# EAGLE design tqfp-sandwich-main (EAGLE 9.6.2)
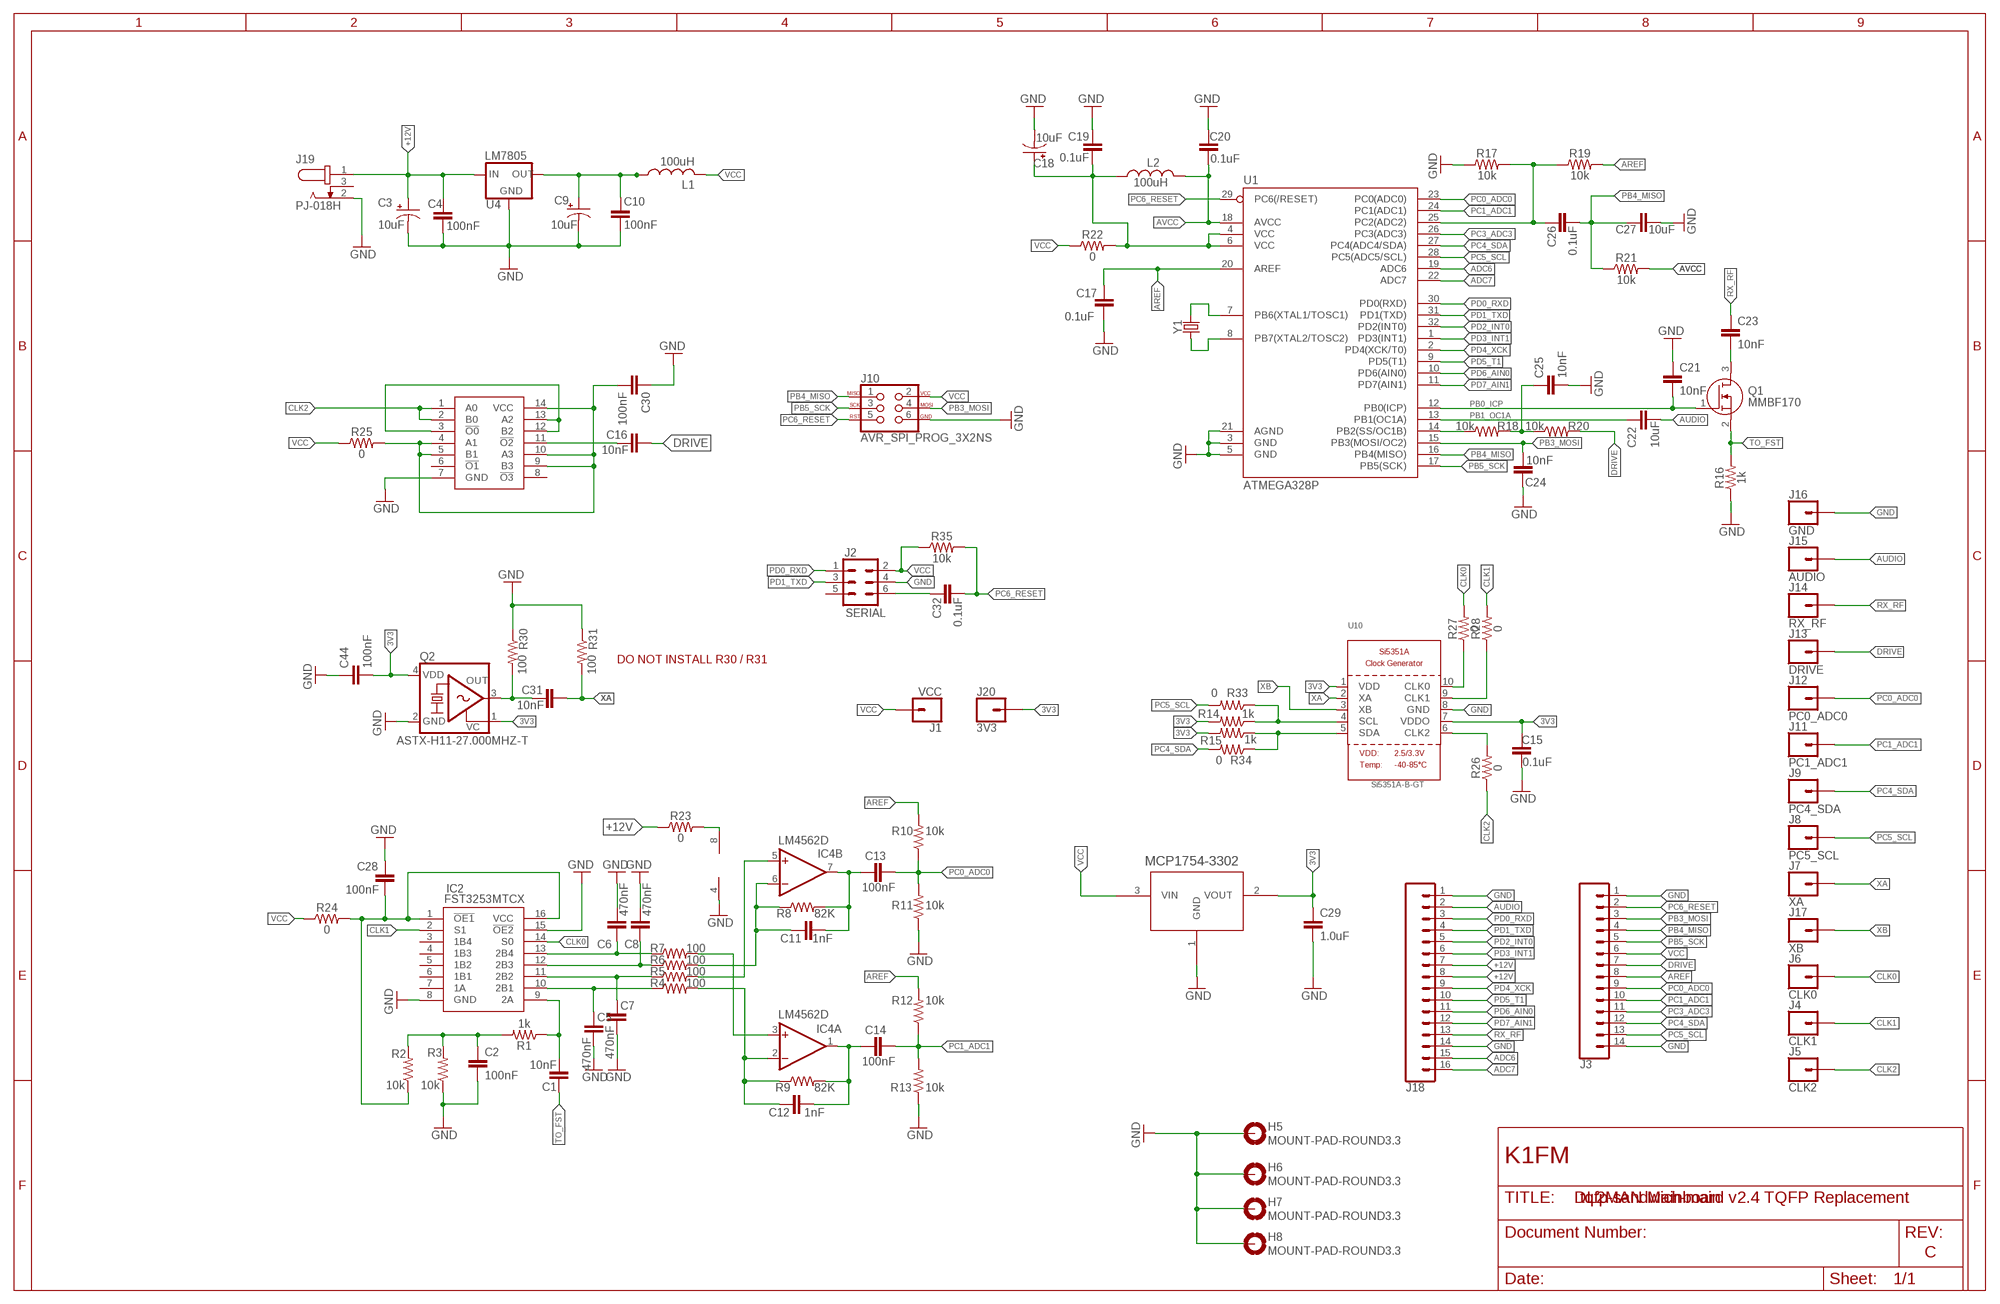
[diagram p0: schematic, sheet 1]

## Parts
C1  10nF  10NF-0603-50V-10%  [0603]
C2  100nF  10NF-0603-50V-10%  [0603]
C3  10uF  10UF-POLAR-EIA3216-16V-10%(TANT)  [EIA3216]
C4  100nF  10NF-0603-50V-10%  [0603]
C5  470nF  470PF-0603-50V-5%  [0603]
C6  470nF  470PF-0603-50V-5%  [0603]
C7  470nF  470PF-0603-50V-5%  [0603]
C8  470nF  470PF-0603-50V-5%  [0603]
C9  10uF  10UF-POLAR-EIA3216-16V-10%(TANT)  [EIA3216]
C10  100nF  10NF-0603-50V-10%  [0603]
C11  1nF  1.0NF/1000PF-0603-50V-10%  [0603]
C12  1nF  1.0NF/1000PF-0603-50V-10%  [0603]
C13  100nF  10NF-0603-50V-10%  [0603]
C14  100nF  10NF-0603-50V-10%  [0603]
C15  0.1uF  0.1UF-0603-25V-(+80/-20%)  [0603]
C16  10nF  10NF-0603-50V-10%  [0603]
C17  0.1uF  0.1UF-0603-25V-(+80/-20%)  [0603]
C18  10uF  10UF-POLAR-EIA3216-16V-10%(TANT)  [EIA3216]
C19  0.1uF  0.1UF-0603-25V-(+80/-20%)  [0603]
C20  0.1uF  0.1UF-0603-25V-(+80/-20%)  [0603]
C21  10nF  10NF-0603-50V-10%  [0603]
C22  10uF  10UF-0603-6.3V-20%  [0603]
C23  10nF  10NF-0603-50V-10%  [0603]
C24  10nF  10NF-0603-50V-10%  [0603]
C25  10nF  10NF-0603-50V-10%  [0603]
C26  0.1uF  0.1UF-0603-25V-(+80/-20%)  [0603]
C27  10uF  10NF-0603-50V-10%  [0603]
C28  100nF  10NF-0603-50V-10%  [0603]
C29  1.0uF  1.0UF-0603-16V-10%  [0603]
C30  100nF  10NF-0603-50V-10%  [0603]
C31  10nF  10NF-0603-50V-10%  [0603]
C32  0.1uF  0.1UF-0603-25V-(+80/-20%)  [0603]
C44  100nF  10NF-0603-50V-10%  [0603]
H5  MOUNT-PAD-ROUND3.3  [3,3-PAD]
H6  MOUNT-PAD-ROUND3.3  [3,3-PAD]
H7  MOUNT-PAD-ROUND3.3  [3,3-PAD]
H8  MOUNT-PAD-ROUND3.3  [3,3-PAD]
IC2  FST3253MTCX  [SOP65P640X110-16N]
IC3  74ACT00MTC  [SOP65P640X120-14N]
IC4  LM4562D  [SO08]
J1  VCC  CONN_01PTH_NO_SILK_KIT  [1X01NS_KIT]
J2  SERIAL  CONN_03X2FEMALE  [2X3]
J3  CONN_14  [1X14]
J4  CLK1  CONN_01PTH_LONGPAD  [1X01_LONGPAD]
J5  CLK2  CONN_01PTH_LONGPAD  [1X01_LONGPAD]
J6  CLK0  CONN_01PTH_LONGPAD  [1X01_LONGPAD]
J7  XA  CONN_01PTH_LONGPAD  [1X01_LONGPAD]
J8  PC5_SCL  CONN_01PTH_LONGPAD  [1X01_LONGPAD]
J9  PC4_SDA  CONN_01PTH_LONGPAD  [1X01_LONGPAD]
J10  AVR_SPI_PROG_3X2NS  [2X3-NS]
J11  PC1_ADC1  CONN_01PTH_LONGPAD  [1X01_LONGPAD]
J12  PC0_ADC0  CONN_01PTH_LONGPAD  [1X01_LONGPAD]
J13  DRIVE  CONN_01PTH_LONGPAD  [1X01_LONGPAD]
J14  RX_RF  CONN_01PTH_LONGPAD  [1X01_LONGPAD]
J15  AUDIO  CONN_01PTH_LONGPAD  [1X01_LONGPAD]
J16  GND  CONN_01PTH_LONGPAD  [1X01_LONGPAD]
J17  XB  CONN_01PTH_LONGPAD  [1X01_LONGPAD]
J18  CONN_16  [1X16]
J19  PJ-018H  [CUI_PJ-018H]
J20  3V3  CONN_01PTH_NO_SILK_KIT  [1X01NS_KIT]
L1  100uH  INDUCTOR_0805_L  [RESC0805_L]
L2  100uH  INDUCTOR_0805_L  [RESC0805_L]
Q1  MMBF170  [SOT96P237X111-3N]
Q2  ASTX-H11-27.000MHZ-T  KXO-VCXO-SINE-84  [3.2X2.5_KXO-84]
R1  1k  1KOHM-0603-1/10W-1%  [0603]
R2  10k  10KOHM-0603-1/10W-1%  [0603]
R3  10k  10KOHM-0603-1/10W-1%  [0603]
R4  100  100OHM-0603-1/4W-5%  [0603]
R5  100  100OHM-0603-1/4W-5%  [0603]
R6  100  100OHM-0603-1/4W-5%  [0603]
R7  100  100OHM-0603-1/4W-5%  [0603]
R8  82K  82OHM-0603-1/10W-1%  [0603]
R9  82K  82OHM-0603-1/10W-1%  [0603]
R10  10k  10KOHM-0603-1/10W-1%  [0603]
R11  10k  10KOHM-0603-1/10W-1%  [0603]
R12  10k  10KOHM-0603-1/10W-1%  [0603]
R13  10k  10KOHM-0603-1/10W-1%  [0603]
R14  1k  1KOHM-0603-1/10W-1%  [0603]
R15  1k  1KOHM-0603-1/10W-1%  [0603]
R16  1k  1KOHM-0603-1/10W-1%  [0603]
R17  10k  10KOHM-0603-1/10W-1%  [0603]
R18  10k  10KOHM-0603-1/10W-1%  [0603]
R19  10k  10KOHM-0603-1/10W-1%  [0603]
R20  10k  10KOHM-0603-1/10W-1%  [0603]
R21  10k  10KOHM-0603-1/10W-1%  [0603]
R22  0  0OHM-0603-1/10W-5%  [0603]
R23  0  0OHM-0603-1/10W-5%  [0603]
R24  0  0OHM-0603-1/10W-5%  [0603]
R25  0  0OHM-0603-1/10W-5%  [0603]
R26  0  0OHM-0603-1/10W-5%  [0603]
R27  0  0OHM-0603-1/10W-5%  [0603]
R28  0  0OHM-0603-1/10W-5%  [0603]
R30  100  1KOHM-0603-1/10W-1%  [0603]
R31  100  1KOHM-0603-1/10W-1%  [0603]
R33  0  0OHM-0603-1/10W-5%  [0603]
R34  0  0OHM-0603-1/10W-5%  [0603]
R35  10k  10KOHM-0603-1/10W-1%  [0603]
U1  ATMEGA328P  ATMEGA328P_TQFP  [TQFP32-08]
U3  MCP1754X-XXXXX/C  [SOT-23A_MC]
U4  LM7805  V_REG_78XX7812  [TO-252]
U10  Si5351A-B-GT  SI5351A  [MSOP10]
Y1  CRYSTALSMD-5X3.2-2PAD  [CRYSTAL-SMD-5X3.2-2PAD]

## Nets
3V3: C15.2 C29.1 C44.2 J20.1 Q2.1(VC) Q2.4(VDD) R14.2 R15.2 U3.2(VOUT) U10.1(VDD) U10.7(VDDO)
5V1: C9.+ C10.2 L1.1 U4.2(OUT)
+12V: C3.+ C4.2 J18.7 J18.8 J19.1 R23.1 U4.1(IN)
ADC6: J18.15 U1.19(ADC6)
ADC7: J18.16 U1.22(ADC7)
AREF: C17.2 J3.8 R10.2 R12.2 R19.2 U1.20(AREF)
AUDIO: C22.2 J15.1 J18.2
AVCC: C20.1 L2.2 R21.2 U1.18(AVCC)
CLK0: IC2.14(S0) J6.1 R27.2
CLK1: IC2.2(S1) J4.1 R28.2
CLK2: IC3.1(A0) IC3.2(B0) J5.1 R26.1
DRIVE: C16.2 J3.7 J13.1 R20.2
GND: C2.2 C3.- C4.1 C5.2 C6.2 C7.2 C8.2 C9.- C10.1 C15.1 C17.1 C18.- C19.2 C20.2 C21.1 C24.1 C25.2 C27.2 C28.1 C29.2 C30.1 C44.1 H5.B3,3(MOUNT) H6.B3,3(MOUNT) H7.B3,3(MOUNT) H8.B3,3(MOUNT) IC2.8(GND) IC2.15(!OE2) IC3.7(GND) IC4.4(P:V-) J2.4 J3.1 J3.14 J10.6 J16.1 J18.1 J18.14 J19.2 Q2.2(GND) R3.1 R11.1 R13.1 R16.1 R17.1 R30.1 R31.1 U1.3(GND) U1.5(GND) U1.21(AGND) U3.1(GND) U4.3(GND) U10.8(GND)
N$1: U1.7(PB6(XTAL1/TOSC1)) Y1.P$2
N$2: U1.8(PB7(XTAL2/TOSC2)) Y1.P$1
N$3: C23.2 Q1.3(D)
N$4: C26.2 R17.2 R19.1 U1.25(PC2(ADC2))
N$5: IC3.3(!O0) IC3.12(B2) IC3.13(A2)
N$6: R18.1 U1.14(PB2(SS/OC1B))
N$7: C25.1 R18.2 R20.1
N$8: C31.1 Q2.3(OUT) R30.2
N$9: C5.1 IC2.10(2B1) R4.1
N$10: C16.1 IC3.11(!O2)
N$11: C18.+ C19.1 L2.1 R22.2 U1.4(VCC) U1.6(VCC)
N$12: C1.2 IC2.9(2A) R1.1
N$13: C2.1 R1.2 R2.2 R3.2
N$14: C7.1 IC2.11(2B2) R5.1
N$15: C8.1 IC2.12(2B3) R6.1
N$16: C6.1 IC2.13(2B4) R7.1
N$17: IC4.5(B:+IN) R5.2
N$18: C12.1 IC4.2(A:-IN) R4.2 R9.1
N$19: C11.1 IC4.6(B:-IN) R6.2 R8.1
N$20: IC4.3(A:+IN) R7.2
N$21: C11.2 C13.1 IC4.7(B:OUT) R8.2
N$22: C12.2 C14.1 IC4.1(A:OUT) R9.2
N$23: IC4.8(P:V+) R23.2
N$24: C28.2 IC2.1(!OE1) IC2.16(VCC) R2.1 R24.2
N$25: C30.2 IC3.4(A1) IC3.5(B1) IC3.9(B3) IC3.10(A3) IC3.14(VCC) R25.2
N$26: R27.1 U10.10(CLK0)
N$27: R28.1 U10.9(CLK1)
N$28: R26.2 U10.6(CLK2)
N$29: R14.1 R33.1 U10.4(SCL)
N$30: R15.1 R34.1 U10.5(SDA)
N$33: C32.2 J2.6
PB0_ICP: C21.2 Q1.1(G) U1.12(PB0(ICP))
PB1_OC1A: C22.1 U1.13(PB1(OC1A))
PB3_MOSI: C24.2 J3.3 J10.4 U1.15(PB3(MOSI/OC2))
PB4_MISO: C26.1 C27.1 J3.4 J10.1 R21.1 U1.16(PB4(MISO))
PB5_SCK: J3.5 J10.3 U1.17(PB5(SCK))
PC0_ADC0: C13.2 J3.9 J12.1 R10.1 R11.2 U1.23(PC0(ADC0))
PC1_ADC1: C14.2 J3.10 J11.1 R12.1 R13.2 U1.24(PC1(ADC1))
PC3_ADC3: J3.11 U1.26(PC3(ADC3))
PC4_SDA: J3.12 J9.1 R34.2 U1.27(PC4(ADC4/SDA))
PC5_SCL: J3.13 J8.1 R33.2 U1.28(PC5(ADC5/SCL))
PC6_RESET: C32.1 J3.2 J10.5 R35.2 U1.29(PC6(/RESET))
PD0_RXD: J2.1 J18.3 U1.30(PD0(RXD))
PD1_TXD: J2.3 J18.4 U1.31(PD1(TXD))
PD2_INT0: J18.5 U1.32(PD2(INT0))
PD3_INT1: J18.6 U1.1(PD3(INT1))
PD4_XCK: J18.9 U1.2(PD4(XCK/T0))
PD5_T1: J18.10 U1.9(PD5(T1))
PD6_AIN0: J18.11 U1.10(PD6(AIN0))
PD7_AIN1: J18.12 U1.11(PD7(AIN1))
RX_RF: C23.1 J14.1 J18.13
TO_FST: C1.1 Q1.2(S) R16.2
VCC: J1.1 J2.2 J3.6 J10.2 L1.2 R22.1 R24.1 R25.1 R35.1 U3.3(VIN)
XA: C31.2 J7.1 R31.2 U10.2(XA)
XB: J17.1 U10.3(XB)
Unconnected: IC2.3(1B4) IC2.4(1B3) IC2.5(1B2) IC2.6(1B1) IC2.7(1A) IC3.6(!O1) IC3.8(!O3) J2.5 J19.3

## Notes on the sheet
- DO NOT INSTALL R30 / R31
- K1FM
- DL2MAN Mainboard v2.4 TQFP Replacement
- C

## Library data of the parts
C1 C16 C21 C23-C25 C31 = SparkFun-Capacitors:10NF: 0.01uF/10nF/10,000pF ceramic capacitors A capacitor is a passive two-terminal electrical component used to store electrical energy temporarily in an electric field. CAP-09321; PROD_ID: CAP-00867
C2 C4 C10 C13 C14 C27 C28 C30 C44 = SparkFun-Capacitors:10NF: 0.01uF/10nF/10,000pF ceramic capacitors A capacitor is a passive two-terminal electrical component used to store electrical energy temporarily in an electric field. CAP-09321; PROD_ID: CAP-00867; VALUE: 10nF
C3 C9 C18 = SparkFun-Capacitors:10UF-POLAR: 10.0µF polarized capacitors A capacitor is a passive two-terminal electrical component used to store electrical energy temporarily in an electric field.; PROD_ID: CAP-00811
C5-C8 = SparkFun-Capacitors:470PF: 470pF ceramic capacitors A capacitor is a passive two-terminal electrical component used to store electrical energy temporarily in an electric field.; PROD_ID: CAP-07884; VALUE: 470pF
C11 C12 = SparkFun-Capacitors:1.0NF/1000PF: 1nF/1,000pF ceramic capacitors A capacitor is a passive two-terminal electrical component used to store electrical energy temporarily in an electric field.; PROD_ID: CAP-07886
C15 C17 C19 C20 C26 C32 = SparkFun-Capacitors:0.1UF: 0.1µF ceramic capacitors A capacitor is a passive two-terminal electrical component used to store electrical energy temporarily in an electric field.; PROD_ID: CAP-00810
C22 = SparkFun-Capacitors:10UF: 10.0µF ceramic capacitors A capacitor is a passive two-terminal electrical component used to store electrical energy temporarily in an electric field.; PROD_ID: CAP-11015
C29 = SparkFun-Capacitors:1.0UF: 1µF ceramic capacitors A capacitor is a passive two-terminal electrical component used to store electrical energy temporarily in an electric field.; PROD_ID: CAP-00868
H5-H8 = holes:MOUNT-PAD-ROUND: MOUNTING PAD, round
IC2 = FST3253MTCX:FST3253MTCX: IC, Fairchild, FST3253MTCX Fairchild Semiconductor FST3253MTCX, Multiplexer/Demultiplexer Dual 4:1 Multiplexer, 4 5.5 V, 16-Pin TSSOP Source: Datasheet <https://componentsearchengine.com/Datasheets/2/FST3253MTCX.pdf>; DESCRIPTION: IC, Fairchild, FST3253MTCX Fairchild Semiconductor FST3253MTCX, Multiplexer/Demultiplexer Dual 4:1 Multiplexer, 4 5.5 V, 16-Pin TSSOP; HEIGHT: 1.1mm; MANUFACTURER_NAME: ON Semiconductor; MANUFACTURER_PART_NUMBER: FST3253MTCX; MOUSER_PART_NUMBER: 512-FST3253MTCX; MOUSER_PRICE-STOCK: https://www.mouser.co.uk/ProductDetail/ON-Semiconductor-Fairchild/FST3253MTCX?qs=9%2FFjV4%2Fi8eqnAjRVZNaJgw%3D%3D
IC3 = 74ACT00MTC:74ACT00MTC: Fairchild Semiconductor 74ACT00MTC, NAND Quad 2 Input NAND, 4.5 5.5 V, 14-Pin TSSOP Source: Datasheet <https://componentsearchengine.com/Datasheets/1/74ACT00MTC.pdf>; DESCRIPTION: Fairchild Semiconductor 74ACT00MTC, NAND Quad 2 Input NAND, 4.5 5.5 V, 14-Pin TSSOP; HEIGHT: 1.2mm; MANUFACTURER_NAME: ON Semiconductor; MANUFACTURER_PART_NUMBER: 74ACT00MTC; MOUSER_PART_NUMBER: 512-74ACT00MTC; MOUSER_PRICE-STOCK: https://www.mouser.com/Search/Refine.aspx?Keyword=512-74ACT00MTC
IC4 = LM4562:LM4562: OP AMP also LM158; LM258; LM2904 Source: http://cache.national.com/ds/LM/LM158.pdf
J1 J4-J9 J11-J17 J20 = SparkFun-Connectors:CONN_01: Single connection point. Often used as Generic Header-pin footprint for 0.1 inch spaced/style header connections On any of the 0.1 inch spaced packages, you can populate with these: Break Away Headers - Straight <https://www.sparkfun.com/products/116> (PRT-00116) Break Away Male Headers - Right Angle <https://www.sparkfun.com/products/553> (PRT-00553) Female Headers <https://www.sparkfun.com/products/115> (PRT-00115) Break Away Headers - Machine Pin <https://www.sparkfun.com/products/117> (PRT-00117) Break Away Female Headers - Swiss Machine Pin <https://www.sparkfun.com/products/743> (PRT-00743) This device is also useful as a general connection point to wire up your design to another part of your project. Our various solder wires solder well into these plated through hole pads. Hook-Up Wire - Assortment (Stranded, 22 AWG) <https://www.sparkfun.com/products/11375> (PRT-11375) Hook-Up Wire - Assortment (Solid Core, 22 AWG) <https://www.sparkfun.com/products/11367> (PRT-11367) View the entire wire category on our website here <https://www.sparkfun.com/categories/141> Special notes: SMTSO-256-ET is a "flush mount" nut for a 4-40 screw. We mostly use this on specialty testbeds; it is a nice way to connect hardware to your PCB at an adjustable hieght. Also note, the SNAP packages are for using a snappable style connector. We sell a baggie of snaps and they are also used on two LilyPad designs: Snap Assortment - 30 pack (male and female) <https://www.sparkfun.com/products/11347> (DEV-11347) LilyPad Arduino SimpleSnap <https://www.sparkfun.com/products/10941> (DEV-10941) LilyPad SimpleSnap Protoboard <https://www.sparkfun.com/products/10940> (DEV-10940)
J2 = SparkFun-Connectors:CONN_03X2: Multi connection point. Often used as Generic Header-pin footprint for 0.1 inch spaced/style header connections You can populate with any combo of single row headers, but if you'd like an exact match, check these: Header - 2x3 (Male, 0.1") <https://www.sparkfun.com/products/12807> (PRT-12807) Header - 2x3 (Female, 0.1") <https://www.sparkfun.com/products/13010> (PRT-13010) 2x3 Pin Shrouded Header <https://www.sparkfun.com/products/10877> (PRT-10877) On any of the 0.1 inch spaced packages, you can populate with these: Break Away Headers - Straight <https://www.sparkfun.com/products/116> (PRT-00116) Break Away Male Headers - Right Angle <https://www.sparkfun.com/products/553> (PRT-00553) Female Headers <https://www.sparkfun.com/products/115> (PRT-00115) Break Away Headers - Machine Pin <https://www.sparkfun.com/products/117> (PRT-00117) Break Away Female Headers - Swiss Machine Pin <https://www.sparkfun.com/products/743> (PRT-00743) Special note: the shrouded connector mates well with our 3x2 ribbon cables: Ribbon Crimp Connector - 6-pin (2x3, Female) <https://www.sparkfun.com/products/10651> (PRT-10651) Ribbon Cable - 6 wire (15ft) <https://www.sparkfun.com/products/10646> (PRT-10646); PROD_ID: CONN-11566; VALUE: FEMALE 2x3
J3 = SparkFun-Connectors:CONN_14: Multi connection point. Often used as Generic Header-pin footprint for 0.1 inch spaced/style header connections On any of the 0.1 inch spaced packages, you can populate with these: Break Away Headers - Straight <https://www.sparkfun.com/products/116> (PRT-00116) Break Away Male Headers - Right Angle <https://www.sparkfun.com/products/553> (PRT-00553) Female Headers <https://www.sparkfun.com/products/115> (PRT-00115) Break Away Headers - Machine Pin <https://www.sparkfun.com/products/117> (PRT-00117) Break Away Female Headers - Swiss Machine Pin <https://www.sparkfun.com/products/743> (PRT-00743) For SCREWTERMINALS and SPRING TERMINALS visit here: Screw Terimnals on SparkFun.com <https://www.sparkfun.com/search/results?term=Screw+Terminals> (5mm/3.5mm/2.54mm spacing) This device is also useful as a general connection point to wire up your design to another part of your project. Our various solder wires solder well into these plated through hole pads. Hook-Up Wire - Assortment (Stranded, 22 AWG) <https://www.sparkfun.com/products/11375> (PRT-11375) Hook-Up Wire - Assortment (Solid Core, 22 AWG) <https://www.sparkfun.com/products/11367> (PRT-11367) View the entire wire category on our website here <https://www.sparkfun.com/categories/141> Special notes: Molex polarized connector foot print use with SKU : PRT-08231 with associated crimp pins and housings. 1MM SMD Version SKU: PRT-10208 NOTES ON THE VARIANTS LOCK and LOCK_LONGPADS... This footprint was designed to help hold the alignment of a through-hole component (i.e. 6-pin header) while soldering it into place. You may notice that each hole has been shifted either up or down by 0.005 of an inch from it's more standard position (which is a perfectly straight line). This slight alteration caused the pins (the squares in the middle) to touch the edges of the holes. Because they are alternating, it causes a "brace" to hold the component in place. 0.005 has proven to be the perfect amount of "off-center" position when using our standard breakaway headers. Although looks a little odd when you look at the bare footprint, once you have a header in there, the alteration is very hard to notice. Also,if you push a header all the way into place, it is covered up entirely on the bottom side.
J10 = SparkFun-Connectors:AVR_SPI_PROG_3X2: AVR ISP 6 Pin This is the reduced ISP connector for AVR programming. Common on Arduino. This footprint will take up less PCB space and can be used with a 10-pin to 6-pin adapter such as SKU: BOB-08508 **Special note about "TEST_POINT" package. The stop mask is on the top side, so if you want your programming test points to be on the bottom of your board, make sure to place this package on the bottom side of the board. This also ensure that the orientation to program from the bottom side will be correct. SparkFun Products: SparkFun ISP Pogo Adapter <https://www.sparkfun.com/products/11591> - NS Tiny AVR Programmer <https://www.sparkfun.com/products/11801> -PTH
J18 = SparkFun-Connectors:CONN_16: Multi connection point. Often used as Generic Header-pin footprint for 0.1 inch spaced/style header connections On any of the 0.1 inch spaced packages, you can populate with these: Break Away Headers - Straight <https://www.sparkfun.com/products/116> (PRT-00116) Break Away Male Headers - Right Angle <https://www.sparkfun.com/products/553> (PRT-00553) Female Headers <https://www.sparkfun.com/products/115> (PRT-00115) Break Away Headers - Machine Pin <https://www.sparkfun.com/products/117> (PRT-00117) Break Away Female Headers - Swiss Machine Pin <https://www.sparkfun.com/products/743> (PRT-00743) For SCREWTERMINALS and SPRING TERMINALS visit here: Screw Terimnals on SparkFun.com <https://www.sparkfun.com/search/results?term=Screw+Terminals> (5mm/3.5mm/2.54mm spacing) This device is also useful as a general connection point to wire up your design to another part of your project. Our various solder wires solder well into these plated through hole pads. Hook-Up Wire - Assortment (Stranded, 22 AWG) <https://www.sparkfun.com/products/11375> (PRT-11375) Hook-Up Wire - Assortment (Solid Core, 22 AWG) <https://www.sparkfun.com/products/11367> (PRT-11367) View the entire wire category on our website here <https://www.sparkfun.com/categories/141> Special notes: Molex polarized connector foot print use with SKU : PRT-08231 with associated crimp pins and housings. 1MM SMD Version SKU: PRT-10208 NOTES ON THE VARIANTS LOCK and LOCK_LONGPADS... This footprint was designed to help hold the alignment of a through-hole component (i.e. 6-pin header) while soldering it into place. You may notice that each hole has been shifted either up or down by 0.005 of an inch from it's more standard position (which is a perfectly straight line). This slight alteration caused the pins (the squares in the middle) to touch the edges of the holes. Because they are alternating, it causes a "brace" to hold the component in place. 0.005 has proven to be the perfect amount of "off-center" position when using our standard breakaway headers. Although looks a little odd when you look at the bare footprint, once you have a header in there, the alteration is very hard to notice. Also,if you push a header all the way into place, it is covered up entirely on the bottom side.
J19 = PJ-018H:PJ-018H: 1.65 mm Center Pin, 3.5 A, Right Angle, Through Hole, Dc Power Jack Connector; MANUFACTURER: CUI INC; STANDARD: Manufacturer recommendations
L1 L2 = Nordic_nRF:INDUCTOR: Generic chip inductor
Q1 = MMBF170:MMBF170: MMBF170 N-Channel MOSFET, 500 mA, 60 V, 3-Pin SOT-23 ON Semiconductor Source: Datasheet <https://www.onsemi.com/pub/Collateral/MMBF170-D.PDF>; DESCRIPTION: MMBF170 N-Channel MOSFET, 500 mA, 60 V, 3-Pin SOT-23 ON Semiconductor; HEIGHT: 1.11mm; MANUFACTURER_NAME: ON Semiconductor; MANUFACTURER_PART_NUMBER: MMBF170; MOUSER_PART_NUMBER: 512-MMBF170; MOUSER_PRICE-STOCK: https://www.mouser.co.uk/ProductDetail/ON-Semiconductor-Fairchild/MMBF170?qs=FOlmdCx%252BAA2suHItufvdcg%3D%3D
Q2 = crystal-geyer_V1_0:KXO-VCXO-SINE: VCXO : Sinewave - Serie Model Size l/w/h [mm] Frequency Range Frequency Stability Temp. Range [°C] Output AECQ 200 availabel Datasheet KXO-81 KXO-86 KXO-84 KXO-83 KXO-82 2.0/1.6/0.7 2.5/2.0/0.7 3.2/2.5/1.0 5.0/3.2/1.5 7.0/5.0/2.0 13,0 ~ 40,0 MHz 13,0 ~ 40,0 MHz 10,0 ~ 26,0 MHz 12,0 ~ 26,0 MHz 12,6 ~ 20,0 MHz ±10 … ±50ppm ±10 … ±50ppm ±10 … ±50ppm ±10 … ±50ppm ±10 … ±50ppm (*) -30°C …+75°C (*) -30°C …+75°C (*) -40°C …+85°C (*) -40°C …+85°C (*) -30°C …+80°C Sinewave Sinewave Sinewave Sinewave Sinewave - - - - - KXO-81.pdf <http://www.geyer-electronic.de/uploads/tx_userartikelfrequenz/GEYER-KXO-81-VCXO-sinewave.pdf> KXO-86.pdf <http://www.geyer-electronic.de/uploads/tx_userartikelfrequenz/GEYER-KXO-86-VCXO-sinewave.pdf> KXO-84.pdf <http://www.geyer-electronic.de/uploads/tx_userartikelfrequenz/GEYER-KXO-84-VCXO-sinewave.pdf> KXO-83.pdf <http://www.geyer-electronic.de/uploads/tx_userartikelfrequenz/GEYER-KXO-83-VCXO-sinewave.pdf> KXO-82.pdf <http://www.geyer-electronic.de/uploads/tx_userartikelfrequenz/GEYER-KXO-82-VCXO-sinewave.pdf> <http://www.geyer-electronic.de/fileadmin/template/img/logo-geyer-electronic.png> Details see: http://www.geyer-electronic.de/Frequenz-Produkte.9.0.html Created 2016-06-07, Hans Locher 2016 (C) Geyer Quartz Technology KXO81,KXO86,KXO84,KXO83,KXO82,2,0x1,6;2.0x1.6;2,5x2,0;2.5x2.0;3,2x2,5;3.2x2.5;5,0x3,2;5.0x3.2;7,0x5,0;7.0x5.0;2016;2520;3225;5032;7050
R1 R14-R16 = SparkFun-Resistors:1KOHM: 1kΩ resistor A resistor is a passive two-terminal electrical component that implements electrical resistance as a circuit element. Resistors act to reduce current flow, and, at the same time, act to lower voltage levels within circuits. - Wikipedia; PROD_ID: RES-07856
R2 R3 R10-R13 R17-R21 R35 = SparkFun-Resistors:10KOHM: 10kΩ resistor A resistor is a passive two-terminal electrical component that implements electrical resistance as a circuit element. Resistors act to reduce current flow, and, at the same time, act to lower voltage levels within circuits. - Wikipedia; PROD_ID: RES-00824
R4-R7 = SparkFun-Resistors:100OHM: 100Ω resistor A resistor is a passive two-terminal electrical component that implements electrical resistance as a circuit element. Resistors act to reduce current flow, and, at the same time, act to lower voltage levels within circuits. - Wikipedia; PROD_ID: RES-12438
R8 R9 = SparkFun-Resistors:82OHM: 82Ω resistor A resistor is a passive two-terminal electrical component that implements electrical resistance as a circuit element. Resistors act to reduce current flow, and, at the same time, act to lower voltage levels within circuits. - Wikipedia; PROD_ID: RES-12311; VALUE: 82
R22-R28 R33 R34 = SparkFun-Resistors:0OHM: 0Ω resistor A resistor is a passive two-terminal electrical component that implements electrical resistance as a circuit element. Resistors act to reduce current flow, and, at the same time, act to lower voltage levels within circuits. - Wikipedia; PROD_ID: RES-08609
R30 R31 = SparkFun-Resistors:1KOHM: 1kΩ resistor A resistor is a passive two-terminal electrical component that implements electrical resistance as a circuit element. Resistors act to reduce current flow, and, at the same time, act to lower voltage levels within circuits. - Wikipedia; PROD_ID: RES-07856; VALUE: 1k
U1 = SparkFun-IC-Microcontroller:ATMEGA328P_TQFP: Popular 328P in QFP Storefront component: ATmega328 - TQFP <https://www.sparkfun.com/products/13448> (COM-13448) Datasheet <http://www.sparkfun.com/datasheets/Components/SMD/ATMega328.pdf> SparkFun Products SparkFun RedBoard - Programmed with Arduino <https://www.sparkfun.com/products/12757> (DEV-12757) Arduino Pro Mini 328 - 5V/16MHz <https://www.sparkfun.com/products/11113> (DEV-11113) Arduino Pro Mini 328 - 3.3V/8MHz <https://www.sparkfun.com/products/11114> (DEV-11114) SparkFun OpenLog <https://www.sparkfun.com/products/13712> (DEV-13712) SparkFun MicroView - OLED Arduino Module <https://www.sparkfun.com/products/12923> (DEV-12923) SparkFun Digital Sandbox <https://www.sparkfun.com/products/12651> (DEV-12651) SparkFun PicoBoard <https://www.sparkfun.com/products/11888> (WIG-11888) Arduino Fio <https://www.sparkfun.com/products/10116> (DEV-10116) LilyPad Arduino 328 Main Board <https://www.sparkfun.com/products/13342> (DEV-13342) SparkFun RedStick <https://www.sparkfun.com/products/13741> (DEV-13741) LilyPad MP3 <https://www.sparkfun.com/products/11013> (DEV-11013) LilyPad Arduino SimpleSnap <https://www.sparkfun.com/products/10941> (DEV-10941) SparkFun Stepoko <https://www.sparkfun.com/products/13899> (ROB-13899) SparkFun Geiger Counter <https://www.sparkfun.com/products/11345> (SEN-11345) SparkFun EL Sequencer <https://www.sparkfun.com/products/12781> (COM-12781) Arduino Pro 328 - 5V/16MHz <https://www.sparkfun.com/products/10915> (DEV-10915) CryptoCape <https://www.sparkfun.com/products/12773> (DEV-12773) SparkFun IR Thermometer Evaluation Board - MLX90614 <https://www.sparkfun.com/products/10740> (SEN-10740) SparkFun RedBot Mainboard <https://www.sparkfun.com/products/12097> (ROB-12097) Arduino Pro 328 - 3.3V/8MHz <https://www.sparkfun.com/products/10914> (DEV-10914) SparkFun Block for Intel® Edison - Arduino <https://www.sparkfun.com/products/13036> (DEV-13036) SparkFun Simon Says - Surface Mount Soldering Kit <https://www.sparkfun.com/products/10935> (KIT-10935) SparkFun 7-Segment Serial Display - Red <https://www.sparkfun.com/products/11441> (COM-11441) SparkFun 7-Segment Serial Display - White <https://www.sparkfun.com/products/11629> (COM-11629) SparkFun 7-Segment Serial Display - Yellow <https://www.sparkfun.com/products/11443> (COM-11443) SparkFun 7-Segment Serial Display - Kelly Green <https://www.sparkfun.com/products/11440> (COM-11440) SparkFun 7-Segment Serial Display - Blue <https://www.sparkfun.com/products/11442> (COM-11442) SparkFun OpenSegment Serial Display - 20mm (Blue) <https://www.sparkfun.com/products/11647> (COM-11647) SparkFun OpenSegment Serial Display - 20mm (Green) <https://www.sparkfun.com/products/11646> (COM-11646) SparkFun OpenSegment Serial Display - 20mm (White) <https://www.sparkfun.com/products/11648> (COM-11648) SparkFun OpenSegment Serial Display - 20mm (Red) <https://www.sparkfun.com/products/11644> (COM-11644) SparkFun OpenSegment Serial Display - 20mm (Yellow) <https://www.sparkfun.com/products/11645> (COM-11645) SparkFun OpenSegment Shield <https://www.sparkfun.com/products/13190> (DEV-13190); PROD_ID: IC-09069; VALUE: ATMEGA328P_TQFP
U3 = MCP1754:MCP1754X-XXXXX/C
U4 = SparkFun-IC-Power:V_REG_78XX: Voltage Regulator Standard 78xx regulator. IGO (Input Ground Output). Spark Fun Electronics SKU : COM-00107; PROD_ID: VREG-12370; VALUE: +12v
U10 = microbuilder:SI5351A: Si5351A 8kHz-160MHz I2C Clock Generator VDD: 2.5V or 3.3V Input Range: 25MHz or 27MHz XTAL User selectable internal input load capacitors: 6, 8 or 10 pF Output Impedance: 85 Ohm Output Load Capacitance: 5-15pF Operating Temperature: -40°C - 85°C Operating Current (3 outputs): 35mA Output buffer voltage (VDDO): 1.8, 2.5 or 3.3V Note: If VDDO is not used it should be connected to VDD. Unused clock out pins should be left floating.
Y1 = SparkFun-Clocks:CRYSTAL: Crystals (Generic) These are passive quartz crystals, which can be used as a clock source for a microcontroller. Crystal's are two-terminal devices. They require external "load" capacitors to generate an oscillating signal.

## Net classes
1 larger: width 0.406 mm, drill 0.35 mm

## Board
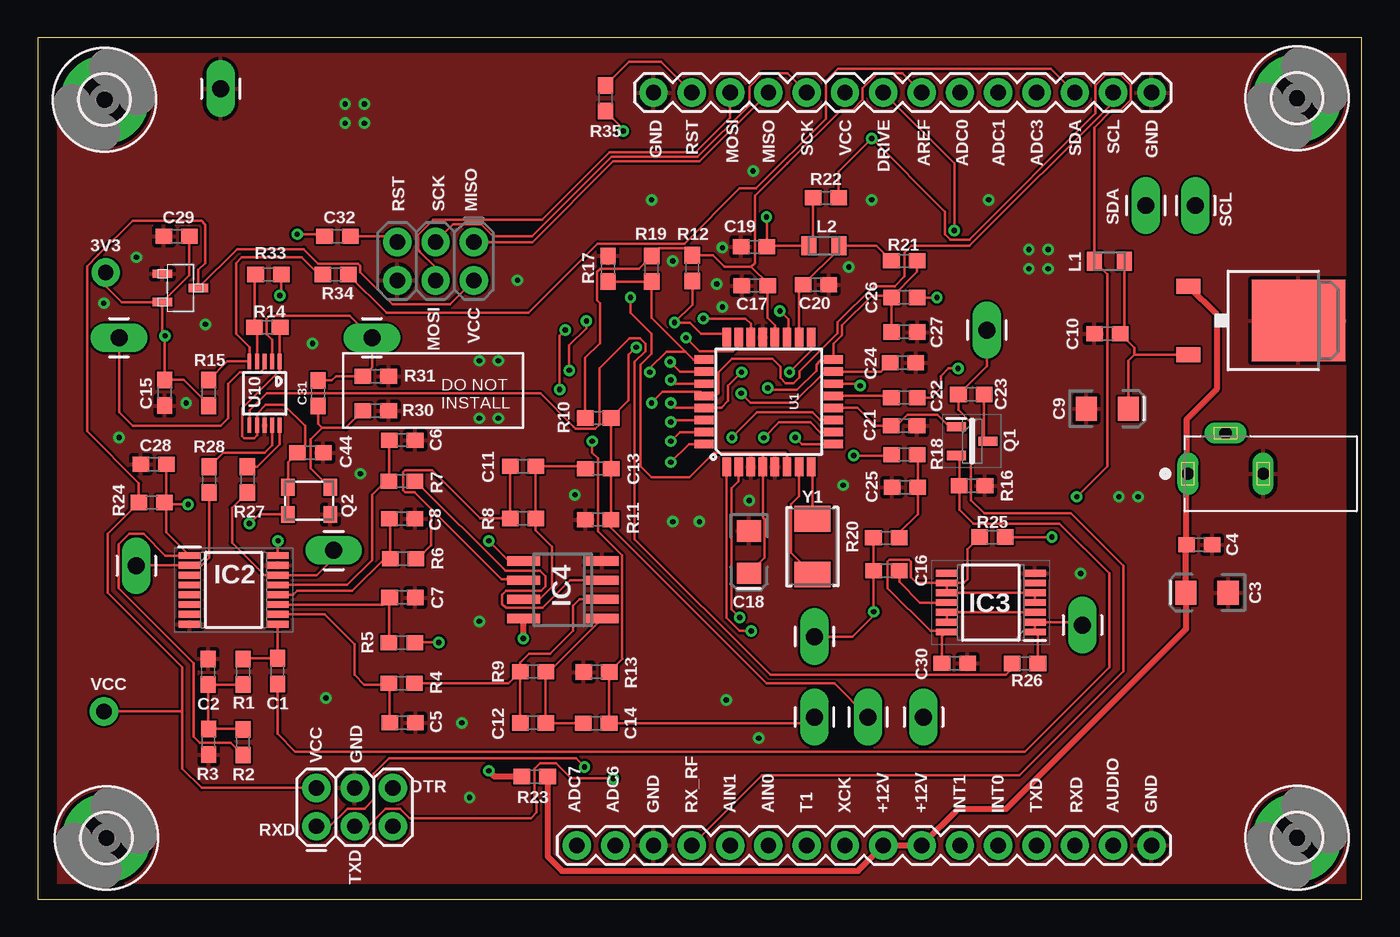
[diagram p1: board, top side]
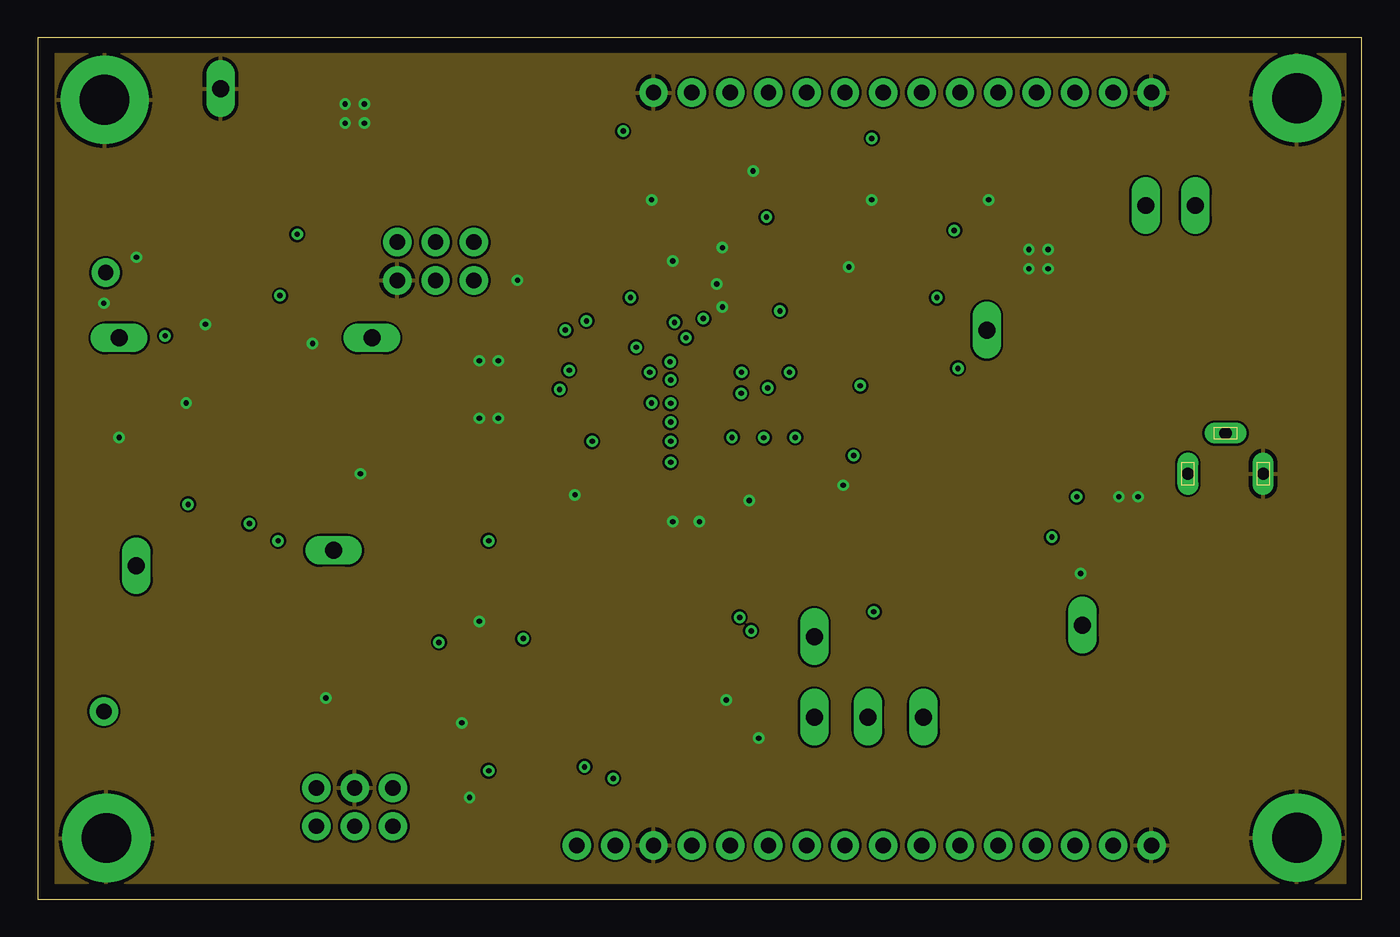
[diagram p2: board, inner layer Route2]
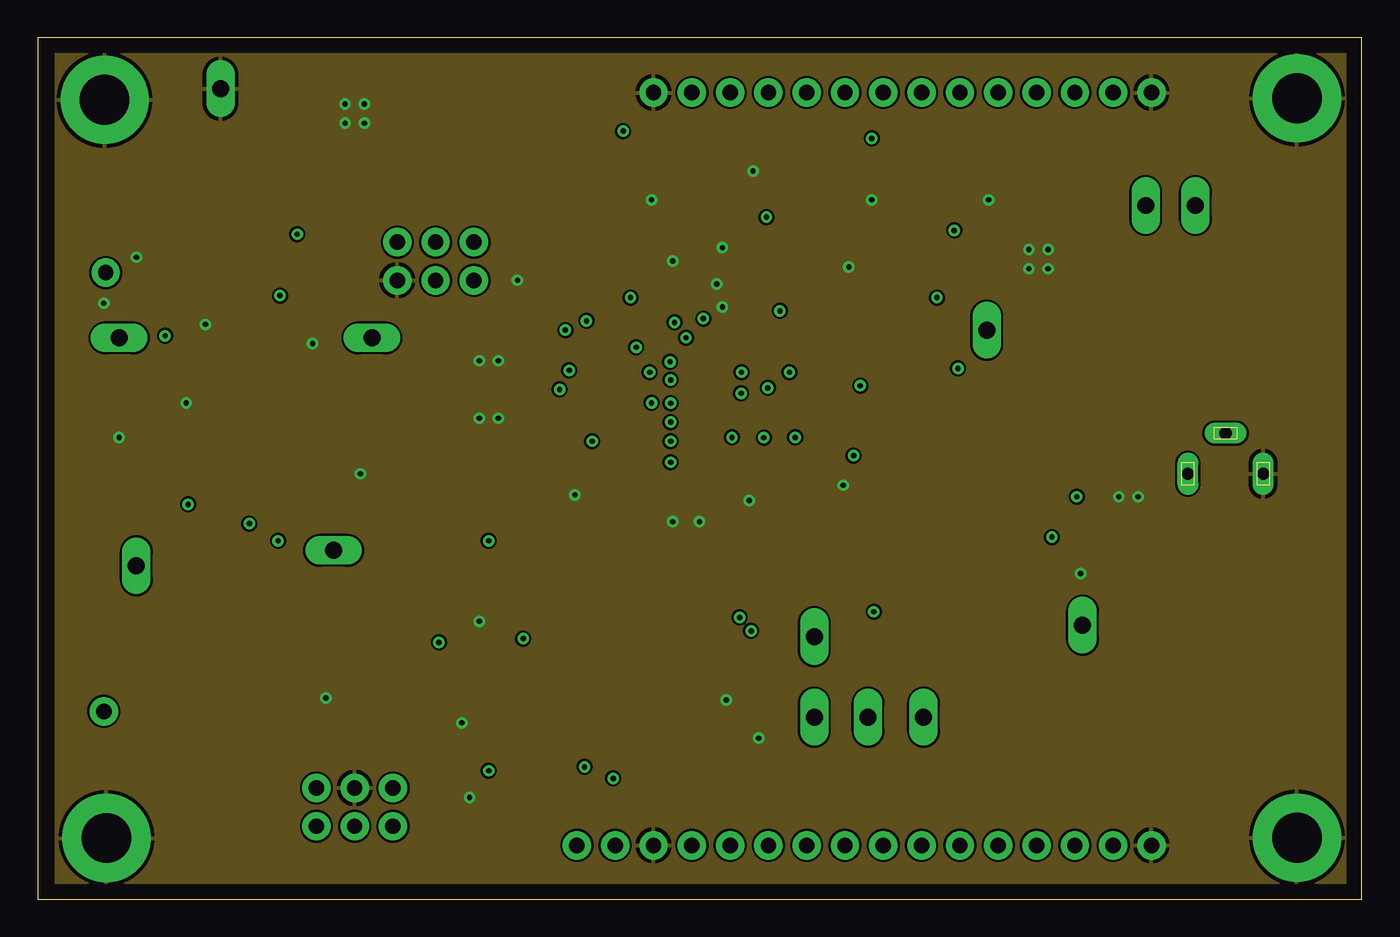
[diagram p3: board, inner layer Route15]
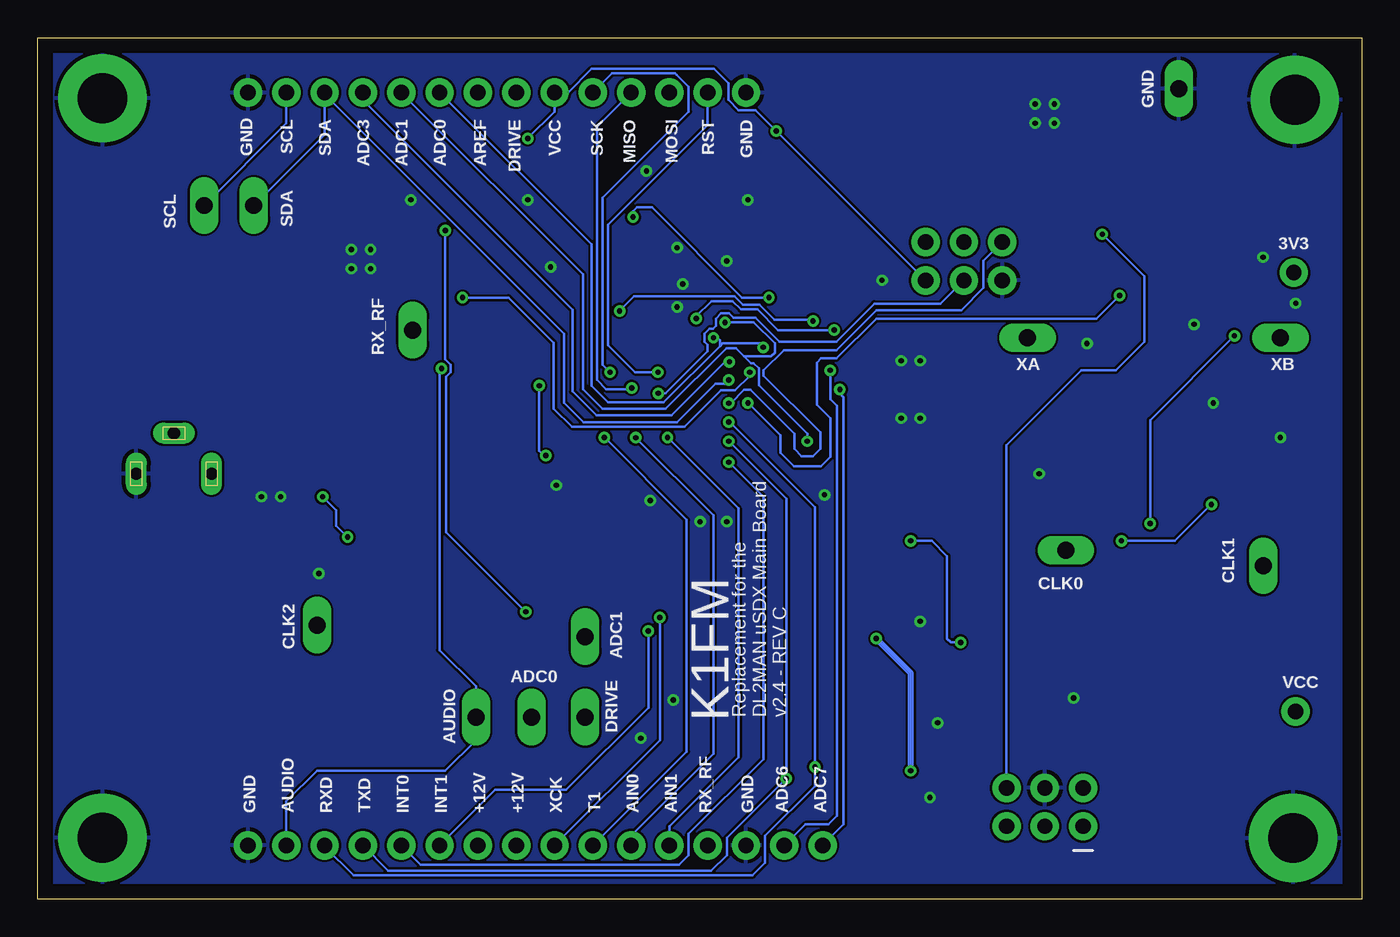
[diagram p4: board, bottom side, seen from below]

Size 87.8 x 57.1 mm. Coordinates in mm from the lower left corner, seen from the top.
Outline: 0,0 87.8,0 87.8,57.1 0,57.1 0,0
Copper layers (1*16): Top 0.035mm / dielectric 1.5mm / Bottom 0.035mm
Design rules "default *": minimum track width 6mil, minimum drill 0.35mm, track to track 6mil, track to pad 6mil, pad to pad 6mil, via to via 6mil, smd to smd 6mil, copper to edge 40mil, drill to drill 6mil, minimum pad ring 10mil, minimum via ring 8mil, stop-mask expansion 4mil, vias tented up to drill 0mil, thermal gap 10mil

### Footprints (pad centres in the part's own frame; a part is rotated, then mirrored left to right if it is on the bottom)
0603 = smd 1.1 x 1: 1 -0.85,0; 2 0.85,0
EIA3216 = smd 1.4 x 1.6: + 1.4,0; - -1.4,0
3,3-PAD = drill 3.3 pad 5.842: B3,3 0,0
SOP65P640X110-16N = smd 1.45 x 0.45: 1 -2.925,2.275; 2 -2.925,1.625; 3 -2.925,0.975; 4 -2.925,0.325; 5 -2.925,-0.325; 6 -2.925,-0.975; 7 -2.925,-1.625; 8 -2.925,-2.275; 9 2.925,-2.275; 10 2.925,-1.625; 11 2.925,-0.975; 12 2.925,-0.325; 13 2.925,0.325; 14 2.925,0.975; 15 2.925,1.625; 16 2.925,2.275
SOP65P640X120-14N = smd 1.45 x 0.45: 1 -2.925,1.95; 2 -2.925,1.3; 3 -2.925,0.65; 4 -2.925,0; 5 -2.925,-0.65; 6 -2.925,-1.3; 7 -2.925,-1.95; 8 2.925,-1.95; 9 2.925,-1.3; 10 2.925,-0.65; 11 2.925,0; 12 2.925,0.65; 13 2.925,1.3; 14 2.925,1.95
SO08 = smd 0.6 x 2.2: 1 -1.905,-2.6; 2 -0.635,-2.6; 3 0.635,-2.6; 4 1.905,-2.6; 5 1.905,2.6; 6 0.635,2.6; 7 -0.635,2.6; 8 -1.905,2.6
1X01NS_KIT = drill 1.016 pad 1.88: 1 0,0
2X3 = drill 1.016 pad 1.88: 1 0,0; 2 0,2.54; 3 2.54,0; 4 2.54,2.54; 5 5.08,0; 6 5.08,2.54
1X14 = drill 1.016 pad 1.88: 1 0,0; 2 2.54,0; 3 5.08,0; 4 7.62,0; 5 10.16,0; 6 12.7,0; 7 15.24,0; 8 17.78,0; 9 20.32,0; 10 22.86,0; 11 25.4,0; 12 27.94,0; 13 30.48,0; 14 33.02,0
1X01_LONGPAD = drill 1.118 pad 1.88 long: 1 0,0
2X3-NS = drill 1.016 pad 1.88: 1 -2.54,-1.27; 2 -2.54,1.27; 3 0,-1.27; 4 0,1.27; 5 2.54,-1.27; 6 2.54,1.27
1X16 = drill 1.016 pad 1.88: 1 0,0; 2 2.54,0; 3 5.08,0; 4 7.62,0; 5 10.16,0; 6 12.7,0; 7 15.24,0; 8 17.78,0; 9 20.32,0; 10 22.86,0; 11 25.4,0; 12 27.94,0; 13 30.48,0; 14 33.02,0; 15 35.56,0; 16 38.1,0
CUI_PJ-018H = drill 0.8 pad 1.4 long: 1 0,0; 2 5,0; 3 2.5,2.7
RESC0805_L = smd 1 x 1.25: 1 -1,0; 2 1,0
SOT96P237X111-3N = smd 1.25 x 0.6: 1 -1.05,0.955; 2 -1.05,-0.955; 3 1.05,0
3.2X2.5_KXO-84 = smd 0.9 x 1.1: 1 -1.4,-0.9; 2 1.4,-0.9; 3 1.4,0.9; 4 -1.4,0.9
TQFP32-08 = smd 1.27 x 0.559: 1 -4.293,2.8; 2 -4.293,2; 3 -4.293,1.2; 4 -4.293,0.4; 5 -4.293,-0.4; 6 -4.293,-1.2; 7 -4.293,-2; 8 -4.293,-2.8; 17 4.293,-2.8; 18 4.293,-2; 19 4.293,-1.2; 20 4.293,-0.4; 21 4.293,0.4; 22 4.293,1.2; 23 4.293,2; 24 4.293,2.8 | smd 0.559 x 1.27: 9 -2.8,-4.293; 10 -2,-4.293; 11 -1.2,-4.293; 12 -0.4,-4.293; 13 0.4,-4.293; 14 1.2,-4.293; 15 2,-4.293; 16 2.8,-4.293; 25 2.8,4.293; 26 2,4.293; 27 1.2,4.293; 28 0.4,4.293; 29 -0.4,4.293; 30 -1.2,4.293; 31 -2,4.293; 32 -2.8,4.293
SOT-23A_MC = smd 0.559 x 1.321: 1 -0.94,-1.194; 2 0.94,-1.194; 3 0,1.194
TO-252 = smd 1 x 1.6: 1 -2.28,-4.8; 2 2.28,-4.8 | smd 5.4 x 6.2: 3 0,2.5
MSOP10 = smd 0.25 x 1: 1 -1,-2.113; 2 -0.5,-2.113; 3 0,-2.113; 4 0.5,-2.113; 5 1,-2.113; 6 1,2.113; 7 0.5,2.113; 8 0,2.113; 9 -0.5,2.113; 10 -1,2.113
CRYSTAL-SMD-5X3.2-2PAD = smd 1.7 x 2.4: P$1 1.85,0; P$2 -1.85,0

### Placement (x,y rotation side)
C1  15.9,15.12 90 top
C2  11.32,15.07 90 top
C3  77.53,20.32 180 top
C4  77.03,23.5 180 top
C5  24.2,11.69 0 top
C6  24.17,30.42 0 top
C7  24.19,19.99 0 top
C8  24.17,25.22 0 top
C9  70.93,32.51 0 top
C10  70.93,37.47 0 top
C11  32.18,28.68 0 top
C12  32.84,11.68 0 top
C13  37.17,28.54 0 top
C14  37.04,11.65 0 top
C15  8.43,33.57 90 top
C16  56.28,21.77 180 top
C17  47.54,40.66 0 top
C18  47.16,23 270 top
C19  47.5,43.24 180 top
C20  51.61,40.72 0 top
C21  57.45,31.37 180 top
C22  57.46,33.24 0 top
C23  61.9,33.45 0 top
C24  57.38,35.57 180 top
C25  57.5,27.31 180 top
C26  57.47,39.88 0 top
C27  57.47,37.59 0 top
C28  7.69,28.83 0 top
C29  9.21,43.94 180 top
C30  60.8,15.65 180 top
C31  18.61,33.53 90 top
C32  19.88,43.94 180 top
C44  18.08,29.59 180 top
H5  4.43,52.99 0 top
H6  83.5,53.09 0 top
H7  4.56,4.05 0 top
H8  83.5,4.06 0 top
IC2  13,20.5 0 top
IC3  63.2,19.66 180 top
IC4  34.82,20.51 90 top
J1  4.38,12.45 0 top
J2  18.48,4.83 0 top
J3  40.83,53.47 0 top
J4  6.54,22.1 0 top
J5  69.28,18.16 0 top
J6  19.62,23.12 90 top
J7  22.16,37.21 90 top
J8  76.77,45.98 0 top
J9  73.47,45.98 0 top
J10  26.39,42.28 180 top
J11  51.5,12.07 0 top
J12  55.06,12.07 0 top
J13  51.5,17.4 0 top
J14  62.93,37.72 0 top
J15  58.74,12.07 0 top
J16  12.13,53.72 0 top
J17  5.4,37.21 90 top
J18  73.85,3.56 180 top
J19  76.27,28.2 0 top
J20  4.51,41.53 0 top
L1  71.06,42.29 180 top
L2  52.14,43.31 0 top
Q1  61.96,30.36 0 top
Q2  18,26.4 0 top
R1  13.61,15.07 270 top
R2  13.62,10.4 90 top
R3  11.32,10.43 90 top
R4  24.12,14.31 0 top
R5  24.15,16.99 0 top
R6  24.22,22.57 0 top
R7  24.15,27.71 0 top
R8  32.18,25.23 0 top
R9  32.84,15.08 0 top
R10  37.17,31.89 180 top
R11  37.16,25.16 0 top
R12  43.41,41.83 90 top
R13  37.05,15.06 0 top
R14  15.23,37.91 0 top
R15  11.33,33.55 270 top
R16  61.96,27.41 180 top
R17  37.82,41.79 270 top
R18  57.48,29.47 0 top
R19  40.72,41.79 90 top
R20  56.27,23.94 180 top
R21  57.46,42.31 180 top
R22  52.26,46.48 180 top
R23  32.96,8.13 180 top
R24  7.56,26.29 0 top
R25  63.31,24 180 top
R26  65.47,15.62 180 top
R27  13.91,27.81 270 top
R28  11.37,27.81 270 top
R30  22.42,32.39 180 top
R31  22.42,34.67 180 top
R33  15.3,41.4 0 top
R34  19.75,41.4 0 top
R35  37.66,53.09 90 top
U1  48.48,32.96 90 top
U3  9.46,40.51 270 top
U4  81.09,38.35 270 top
U10  15.04,33.52 180 top
Y1  51.37,23.37 90 top

### Tracks (layer width: path | path; a pad name or v marks a point on that pad's centre or on a via)
3V3  (via drill 0.35)
  Top 0.152: R14.2 16.05,37.87 U10.1 16.05,35.03 13.56,32.55 13.56,30.69 13.7,30.56 14.36,30.56 14.54,30.74 U10.7 14.54,32.18 15.13,32.77 16.32,32.77 17.72,31.37 17.72,30.08 C44.2 16.6,28.97 Q2.4 Q2.1 16.58,25.53 14.67,25.53 v14.04,24.89 | C15.2 8.44,34.44 9.66,34.44 11.32,32.78 R15.2 | C15.2 8.43,37.32 v8.45,37.34 8.27,37.52 U3.2 | 8.39,34.38 C15.2 | U3.2 10.06,41.36 C29.1 | J20.1 4.51,40.64 5.58,39.57 U3.2
  Bottom 0.152: v14.04,24.89 14.04,31.75 v8.45,37.34
5V1
  Top 0.152: L1.1 72.06,37.74 C10.2 72.71,36.54 72.71,36.07 | C9.+ 72.33,35.69 72.71,36.07 | U4.2 72.72,36.07 72.71,36.07
+12V
  Top 0.406: R23.1 33.81,2.83 34.76,1.88 54.4,1.88 J18.8 J18.7 61.03,5.97 64.2,5.97 76.14,17.9 C3.+ 76.14,23.45 C4.2 76.18,28.11 | 76.18,28.11 J19.1 | U4.1 78.17,38.76 78.17,33.78 76.18,31.79 76.18,28.11
ADC6  (via drill 0.35)
  Top 0.152: U1.19 49.77,37.34 49.77,38.43 v49.21,38.99 | v36.39,38.33 36.39,37.85 35.24,36.7 v35.24,35.05
  Bottom 0.152: v49.21,38.99 48.25,39.95 41.6,39.95 41.04,39.4 39.95,39.4 38.96,38.41 36.47,38.41 v36.39,38.33 | v35.24,35.05 35.24,33.15 34.79,32.69 34.79,5.54 35.37,4.95 36.9,4.95 J18.15
ADC7  (via drill 0.35)
  Top 0.152: v34.99,37.72 34.61,37.34 v34.61,33.78 | U1.22 47.28,38.13 46.93,38.48 v44.13,38.48
  Bottom 0.152: J18.16 34.36,4.95 34.36,33.27 34.61,33.53 v34.61,33.78 | v44.13,38.48 44.13,38.63 43.12,39.65 41.72,39.65 41.17,39.09 40.07,39.09 38.7,37.72 v34.99,37.72
AREF
  Top 0.152: J3.8 57.34,54.74 55.69,54.74 54.7,53.75 54.7,52.98 54.02,52.3 53.25,52.3 49.72,48.77 47.56,46.61 47.56,42.16 47.31,41.91 | U1.20 48.88,38.05 48.4,38.54 C17.2 48.48,40.74 47.31,41.91 | 47.31,41.91 45.53,41.91 44.76,42.68 R12.2 42.94,43.15 41.22,43.15 R19.2 39.86,41.78 37.28,41.78 37.28,41.77 37.09,41.58 37.09,39.68 37.28,39.5 37.28,36.85 36.3,35.87 36.3,31.91 R10.2
AUDIO  (via drill 0.35)
  Top 0.152: v61.03,35.18 60.39,35.18 59.88,34.67 59.88,33.91 59.22,33.24 C22.2
  Bottom 0.152: v61.03,35.18 61.15,35.05 61.15,16.51 58.74,14.1 J15.1 58.74,10.54 60.77,8.51 69.28,8.51 71.31,6.48 J18.2
AVCC
  Top 0.152: R21.2 55.61,43.31 L2.2 53.14,43.09 C20.1 50.48,40.44 U1.18
CLK0
  Top 0.152: J6.1 19.62,22.61 18.49,21.48 IC2.14 15.04,21.48 12.89,23.62 12.89,25.95 R27.2
CLK1
  Top 0.152: J4.1 6.57,22.13 IC2.2 10.86,22.13 11.37,22.63 R28.2
CLK2
  Top 0.152: R26.1 66.32,17.51 IC3.1 IC3.2 69.08,18.36 J5.1
DRIVE  (via drill 0.35)
  Top 0.152: R20.2 55.42,21.79 C16.2 v55.43,19.05 | J3.7 60.77,48.77 v60.77,44.32 | v55.44,19.05 v55.43,19.05 | J13.1 54.04,17.4 55.43,18.79 v55.43,19.05
  Bottom 0.152: v60.77,44.32 60.77,35.78 60.42,35.43 60.42,34.93 60.72,34.63 60.72,24.33 v55.44,19.05
GND  (via drill 0.35)
  other vias: 9.84,32.89 6.54,42.55 53.79,41.91 42.1,42.29 45.4,39.24 11.11,38.1 18.23,36.83 4.38,39.5 55.31,46.36 63.06,46.36 28.64,6.73 65.72,43.05 66.99,43.05 66.99,41.78 65.72,41.78 42.1,25.02 43.88,25.02 35.62,26.8 47.82,10.67 45.66,13.21 69.15,21.59 29.27,31.88 30.54,31.88 29.27,35.69 30.54,35.69 71.69,26.67 72.96,26.67 53.41,27.43 31.81,41.02 40.71,46.36 20.38,52.71 21.65,52.71 21.65,51.44 20.38,51.44 19.11,13.34 29.27,18.42 28.13,11.68 21.4,28.2 5.4,30.61 45.02,40.77 47.44,48.26 47.18,26.42 45.4,43.18
  pour Bottom: 1.36,56.72 87.67,56.72 87.67,0.25 1.36,0.25
  pour Top: 1.36,56.74 87.67,56.74 87.67,0.25 1.36,0.25
  pour Route2: 1.21,56.77 86.81,56.77 86.81,0.25 1.21,0.25
  pour Route15: 1.21,56.77 87.06,56.77 87.06,0.38 1.21,0.38
N$1
  Top 0.152: U1.7 50.48,26.7 49.94,26.16 49.94,22.95 Y1.P$2
N$2
  Top 0.152: U1.8 51.37,28.58 Y1.P$1
N$3
  Top 0.152: C23.2 62.75,30.62 Q1.3
N$4  (via drill 0.35)
  Top 0.152: R17.2 R19.1 40.72,38.53 42.96,36.29 | U1.25 43.48,35.76 42.96,36.29 | C26.2 v59.63,39.88 | v40.58,34.93 40.58,35.18 41.69,36.29 42.96,36.29
  Bottom 0.152: v59.63,39.88 56.58,39.88 53.58,36.88 53.58,32.52 52.38,31.32 44.9,31.32 42.49,33.73 41.55,33.73 40.58,34.7 v40.58,34.93
N$5
  Top 0.152: IC3.13 IC3.12 IC3.3
N$6  (via drill 0.35)
  Top 0.152: U1.14 54.42,34.16 v54.55,34.04 | v54.1,29.4 56.56,29.4 R18.1
  Bottom 0.152: v54.55,34.04 54.55,29.72 54.17,29.34 v54.1,29.4
N$7
  Top 0.152: R18.2 58.35,29.44 C25.1 58.35,25.52 57.12,24.29 R20.1
N$8
  Top 0.152: 21.27,32.68 R30.2 20.42,31.24 18.86,31.24 | Q2.3 19.37,27.3 18.1,28.58 18.1,30.48 18.86,31.24 | C31.1 18.61,31.5 18.86,31.24
N$9
  Top 0.152: R4.1 23.35,14.24 23.35,14.23 | 23.35,14.23 C5.1 | IC2.10 19.04,18.88 21.02,16.89 21.02,14.86 21.65,14.23 23.35,14.23
N$10
  Top 0.152: C16.1 57.13,21.04 58.51,19.66 IC3.11
N$11  (via drill 0.35)
  Top 0.152: R22.2 51.41,43.59 L2.1 48.42,43.31 C19.1 48.35,45.19 v48.33,45.21 | 48.2,29.59 48.08,29.48 U1.4 48.08,25.31 48.19,25.2 48.19,22.63 C18.+ | U1.6 49.68,29.51 49.6,29.59 48.2,29.59 | 48.2,29.59 44.86,29.59 43.23,27.97 40.71,27.97 39.97,28.71 39.97,35.43 40.71,36.16 40.71,37.47 39.31,38.87 v39.31,39.88
  Bottom 0.152: v39.31,39.88 41.09,39.88 47.05,45.85 48.07,45.85 48.33,45.59 v48.33,45.21
N$12
  Top 0.152: R1.1 13.66,15.97 C1.2 15.92,15.99 IC2.9
N$13
  Top 0.152: R1.2 C2.1 R3.2 13.59,11.28 R2.2
N$14
  Top 0.152: IC2.11 22.87,19.53 C7.1 23.3,19.96 R5.1
N$15
  Top 0.152: IC2.12 16.94,20.18 17.19,20.43 20.85,20.43 22.99,22.57 R6.1 23.37,25.16 C8.1
N$16
  Top 0.152: C6.1 23.3,30.4 R7.1 23.07,27.71 22.16,26.8 22.16,22.48 20.51,20.83 IC2.13
N$17  (via drill 0.35)
  Top 0.152: IC4.5 31.25,22.41 v29.91,23.75 | v26.61,17.02 25.02,17.02 R5.2
  Bottom 0.152: v29.91,23.75 28.51,23.75 27.5,22.73 27.5,17.27 27.24,17.02 v26.61,17.02
N$18
  Top 0.152: R4.2 31.22,14.31 R9.1 | R9.1 C12.1 | IC4.2 35.94,19.87 35.5,19.43 35.5,17.78 33.97,16.26 32.58,16.26 31.99,15.67 R9.1
N$19
  Top 0.152: C11.1 R8.1 29.35,25.23 26.15,28.43 24.35,28.43 24.22,28.3 24.22,27.11 24.35,26.98 24.99,26.98 26.1,25.87 | R6.2 25.21,22.57 26.1,23.46 26.1,25.87 | IC4.6 32.16,21.2 30.77,21.2 26.1,25.87
N$20
  Top 0.152: R7.2 25.07,27.71 31.02,21.76 33.32,21.76 33.67,21.41 33.67,20.75 33.37,20.45 31.07,20.45 30.8,20.18 30.8,19.56 31.05,19.3 33.47,19.3 35.3,21.14 IC4.3
N$21
  Top 0.152: C13.1 36.18,28.68 C11.2 R8.2 33.03,24.44 34.1,23.37 34.1,20.7 33.27,19.87 IC4.7
N$22
  Top 0.152: IC4.1 33.89,15.08 | 33.89,15.08 R9.2 | C14.1 33.72,11.65 C12.2 33.69,14.88 33.89,15.08
N$23  (via drill 0.35)
  Top 0.406: R23.2 30.29,8.13 v29.91,8.51 | v32.2,17.27 32.22,17.29 IC4.8
  Bottom 0.406: v29.91,8.51 29.91,14.99 v32.2,17.27
N$24  (via drill 0.35)
  Top 0.152: 8.54,26.16 R24.2 8.54,26.42 C28.2 | 8.54,26.16 8.54,24.31 IC2.1 8.46,22.78 7.03,24.21 6.06,24.21 5.37,23.52 5.37,20.6 10.35,15.62 10.35,10.75 10.73,10.37 12.8,10.37 R2.1 | IC2.16 15.92,23.73 v15.94,23.75 | v9.97,26.16 8.54,26.16
  Bottom 0.152: v9.97,26.16 12.38,23.75 v15.94,23.75
N$25
  Top 0.152: IC3.9 | IC3.9 IC3.10 IC3.5 IC3.4 | R25.2 61.66,23.2 61.66,21.21 61.41,20.96 IC3.9 | C30.2 59.96,17.39 IC3.14 60.21,17.78 59.2,17.78 56.35,20.62 56.35,22.36 56.49,22.5 57.78,22.5 57.91,22.36 57.91,21.33 58.28,20.96 IC3.9
N$26
  Top 0.152: R27.1 14.54,28.66 16.05,30.17 U10.10
N$27
  Top 0.152: R28.1 12.3,29.59 15.04,29.59 15.54,30.1 15.54,30.85 15.54,31.37 U10.9
N$28
  Top 0.152: U10.6 14.04,32.4 15.18,33.53 33.34,33.53 35.54,31.33 35.54,31.3 35.67,31.16 36.96,31.16 37.24,31.44 37.24,35.19 39.23,37.18 39.94,37.18 40.3,36.83 40.3,36.33 39.59,35.62 39.59,23.85 48.58,14.86 64.2,14.86 64.62,15.28 R26.2
N$29
  Top 0.152: R33.1 14.38,41.33 R14.1 14.54,37.74 U10.4
N$30
  Top 0.152: R34.1 18.65,41.4 17.5,42.55 13.53,42.55 13.15,42.16 13.15,37.47 14.04,36.57 U10.5 12.56,35.64 R15.1
N$33  (via drill 0.35)
  Top 0.152: v17.21,44.07 18.9,44.07 C32.2
  Bottom 0.152: J2.6 23.56,30.1 18.61,35.05 16.32,35.05 14.42,36.96 14.42,41.28 v17.21,44.07
PB0_ICP
  Top 0.152: U1.12 54.37,32.56 55.56,31.37 C21.2 56.93,31.37 57.66,32.1 59.12,32.1 59.66,32.1 60.44,31.32 Q1.1
PB1_OC1A
  Top 0.152: C22.1 56.49,33.36 U1.13
PB3_MOSI  (via drill 0.35)
  Top 0.152: C24.2 55.93,34.96 U1.15 52.19,34.96 50.12,32.89 47.28,32.89 v46.64,33.53 | J3.3 45.91,51.79 43.63,49.51 37.91,49.51 33.43,45.03 26.21,45.03 25.22,44.04 25.22,43.07 25.34,42.95 25.34,42.93 26.39,41.88 J10.4
  Bottom 0.152: v46.64,33.53 46.17,33.53 43.37,36.32 43.37,36.73 43.6,36.96 43.6,37.46 43.24,37.82 43.02,37.82 42.84,38 42.84,38.48 42.48,38.84 41.98,38.84 41.68,38.53 40.2,38.53 38.62,36.96 34.84,36.96 32.32,39.47 27.93,39.47 J10.4
PB4_MISO  (via drill 0.35)
  Top 0.152: R21.1 58.31,41.57 C26.1 | v48.42,33.88 48.54,33.76 50.35,33.76 51.63,35.03 51.63,35.43 51.88,35.69 52.7,35.69 U1.16 52.77,36.82 53.33,37.38 53.33,38.02 55.31,40.01 56.49,40.01 C26.1 | C27.1 C26.1 | J10.1 32.82,43.55 38.17,48.9 43.88,48.9 J3.4
  Bottom 0.152: v48.42,33.88 48.48,33.81 50.1,33.81 50.71,34.42 50.71,51.21 J3.4
PB5_SCK  (via drill 0.35)
  Top 0.152: U1.17 51.28,36.36 v49.85,34.93 | J10.3 27.56,44.72 29.41,44.72 30.19,43.94 32.78,43.94 38.04,49.2 43.75,49.2 47.18,52.63 47.18,53.85 48.07,54.74 49.72,54.74 J3.5
  Bottom 0.152: J3.5 49.72,54.74 45.53,54.74 45.43,54.64 44.64,53.85 44.64,52.2 50.36,46.48 50.36,35.43 v49.85,34.93
PC0_ADC0  (via drill 0.35)
  Top 0.152: U1.23 46.44,37.22 46.44,36.65 46.11,36.32 43.88,36.32 v42.99,37.21 | J12.1 52.82,14.3 48.33,14.3 38.01,24.62 R11.2 38.02,25.17 C13.2 R10.1 39.18,33.06 39.18,36.07 v39.69,36.58
  Bottom 0.152: J3.9 51.09,43.41 51.09,34.04 49.97,32.92 46.3,32.92 42.56,36.66 | 42.56,36.66 42.39,36.83 39.94,36.83 v39.69,36.58 | v42.99,37.21 42.74,37.21 42.56,37.04 42.56,36.66
PC1_ADC1  (via drill 0.35)
  Top 0.152: U1.24 45.47,37.47 43.98,37.47 43.24,38.2 42.26,38.2 v42.23,38.23 43.41,39.4 R12.1 | J11.1 51.09,11.65 C14.2 37.89,15.04 R13.2 38.79,15.94 38.74,15.99 38.74,22.81 37.15,24.4 37.15,29.21 36.77,29.59 v36.77,30.35
  Bottom 0.152: v36.77,30.35 36.77,30.86 39.97,34.07 39.97,35.18 40.33,35.53 40.52,35.53 40.96,35.97 | v42.23,38.23 40.32,38.23 38.93,36.83 38.93,36.23 39.18,35.97 40.96,35.97 | J3.10 51.65,41.43 51.65,33.79 50.35,32.49 46.17,32.49 42.13,36.53 41.51,36.53 40.96,35.97
PC3_ADC3  (via drill 0.35)
  Top 0.152: v41.93,35.62 42.59,34.96 U1.26
  Bottom 0.152: J3.11 66.23,52.96 52.34,39.06 52.34,33.66 50.73,32.06 45.79,32.06 42.23,35.62 v41.93,35.62
PC4_SDA  (via drill 0.35)
  Top 0.152: v41.98,34.42 42.23,34.16 U1.27 | J3.12 67.2,55.04 53.07,55.04 52.26,54.23 52.26,51.74 47.64,47.12 46.55,47.12 42.89,43.46 37.14,43.46 32.54,38.86 23.14,38.86 R34.2
  Bottom 0.152: v41.98,34.42 42.23,34.16 42.87,34.16 45.41,31.63 51.62,31.63 52.89,32.9 52.89,37.46 68.77,53.34 J3.12 68.77,50.67 J9.1
PC5_SCL  (via drill 0.35)
  Top 0.152: v40.71,32.89 41.43,33.62 43.94,33.62 U1.28 44.98,33.36 45.15,33.53 45.15,34.93 46.04,35.81 48.71,35.81 49.24,35.28 49.24,34.55 49.6,34.19 50.1,34.19 50.51,34.6 50.51,34.99 53.02,37.51 53.02,38.23 55.44,40.64 56.83,40.64 57.47,41.28 57.47,42.84 57.94,43.31 61.79,43.31 71.31,52.83 J3.13 | R33.2 16.16,40.09 v16.07,40.01
  Bottom 0.152: v16.07,40.01 17.59,38.48 32.2,38.48 34.84,35.84 35.85,35.84 36.13,35.56 36.13,32.77 35.24,31.88 35.24,29.34 35.88,28.7 37.66,28.7 38.55,29.59 38.55,30.73 v40.71,32.89 | J8.1 71.31,51.44 J3.13
PC6_RESET  (via drill 0.35)
  Top 0.152: v41.98,32.87 42.29,32.56 U1.29 45.33,32.56 45.79,33.02 45.79,34.04 v46.67,34.93 | R35.2 39.22,55.5 41.34,55.5 J3.2 | C32.1 23.46,43.94 J10.5
  Bottom 0.152: J3.2 43.37,51.31 49.98,44.71 49.98,36.7 48.2,34.93 v46.67,34.93 | v41.98,32.87 41.84,32.87 40.96,33.76 40.55,33.76 37.63,30.83 37.63,29.85 37.15,29.37 36.39,29.37 35.91,29.85 35.91,30.94 39.67,34.7 39.67,35.06 38.32,36.4 34.84,36.4 32.2,39.04 26.56,39.04 25.08,40.51 25.08,42.32 J10.5
PD0_RXD  (via drill 0.35)
  Top 0.152: U1.30 44.18,31.75 42.1,31.75 v41.98,31.62 | J2.1 19.37,4.83 20.54,5.99 21.68,5.99 22.29,6.6 22.29,8.32 23.29,9.32 35.7,9.32 v36.26,8.76
  Bottom 0.152: v41.98,31.62 41.9,31.62 36.26,25.99 v36.26,8.76 36.26,7.49 39.56,4.19 39.56,2.41 40.4,1.58 66.87,1.58 68.77,3.48 J18.3
PD1_TXD  (via drill 0.35)
  Top 0.152: U1.31 42.59,30.96 v41.98,30.35 | J2.3 21.91,4.83 23.08,5.99 24.04,5.99 24.68,5.36 32.7,5.36 33.09,5.75 33.09,6.48 32.96,6.6 32.96,8.65 33.32,9.02 34.36,9.02 35.37,8 v38.17,8
  Bottom 0.152: v41.98,30.35 38.17,26.54 v38.17,8 42.1,4.06 42.1,2.92 43.14,1.88 64.56,1.88 J18.4
PD2_INT0  (via drill 0.35)
  Top 0.152: U1.32 43.18,30.16 v41.98,28.96
  Bottom 0.152: v41.98,28.96 39.69,26.67 39.69,9.27 44.64,4.32 44.64,2.92 45.28,2.29 62.42,2.29 J18.5
PD3_INT1  (via drill 0.35)
  Top 0.152: U1.1 45.68,18.65 46.55,17.78 v47.31,17.78
  Bottom 0.152: v47.31,17.78 47.31,12.7 52.77,7.24 57.47,7.24 J18.6
PD4_XCK  (via drill 0.35)
  Top 0.152: U1.2 46.48,27.71 46.01,27.23 46.01,19.21 v46.55,18.67
  Bottom 0.152: v46.55,18.67 46.55,10.54 J18.9
PD5_T1  (via drill 0.35)
  Top 0.152: U1.9 50.67,30.16 v50.23,30.61
  Bottom 0.152: v50.23,30.61 44.77,25.15 44.77,9.78 J18.10
PD6_AIN0  (via drill 0.35)
  Top 0.152: U1.10 51.89,30.96 51.25,31.6 49.16,31.6 v48.15,30.59
  Bottom 0.152: v48.15,30.59 42.99,25.43 42.99,9.65 48.45,4.19 J18.11
PD7_AIN1  (via drill 0.35)
  Top 0.152: U1.11 51.89,31.76 51.38,32.27 47.7,32.27 v46.04,30.61
  Bottom 0.152: v46.04,30.61 41.34,25.91 41.34,9.4 45.91,4.83 J18.12
RX_RF
  Top 0.152: J14.1 62.93,35.33 C23.1 61.05,32.43 61.89,31.59 61.89,26.45 62.76,25.58 68.52,25.58 72,22.1 72,15.12 65.09,8.2 48.02,8.2 J18.13
TO_FST
  Top 0.152: Q1.2 61.11,29.21 R16.2 61.11,25.82 62.04,24.89 67.76,24.89 71.06,21.59 71.06,15.37 65.47,9.78 17.08,9.78 15.9,10.96 C1.1
VCC  (via drill 0.35)
  Top 0.152: R25.1 v67.25,24 | R22.1 53.11,48.22 v55.31,50.42 60.16,45.57 60.16,44.07 60.52,43.72 61.77,43.72 70.14,52.1 70.14,53.95 70.83,54.64 71.8,54.64 72.48,53.95 72.48,52.98 71.8,52.3 71.21,52.3 70.06,51.15 L1.2 70.93,41.42 70.93,28.7 v68.9,26.67 | J10.2 27.34,39.42 23.52,39.42 21.38,41.56 21.38,42 21.25,42.13 18.6,42.13 17.65,43.09 13.23,43.09 U3.3 10.66,41.71 11.11,42.16 11.11,44.71 10.86,44.96 6.29,44.96 4.03,42.7 3.29,41.96 3.29,31 6.71,27.58 R24.1 4.64,24.22 4.64,20.32 9.59,15.37 9.59,12.32 | J2.2 10.86,7.37 9.59,8.64 9.59,12.32 | v38.82,50.91 38.82,51.07 R35.1 | J1.1 9.46,12.45 9.59,12.32
  Bottom 0.152: v55.31,50.42 53.53,52.2 J3.6 52.64,53.47 51.07,55.04 42.96,55.04 42,54.09 42,52.98 41.32,52.3 40.21,52.3 v38.82,50.91 J10.2 | v68.9,26.67 68.01,25.78 68.01,24.77 v67.25,24
XA
  Top 0.152: U10.2 15.54,37.07 15.17,37.44 15.17,38.48 15.38,38.68 20.69,38.68 J7.1 22.16,35.27 R31.2 19.79,34.67 19.5,34.38 C31.2
XB
  Top 0.152: U10.3 15.04,35.19 14.76,34.91 13.38,34.91 12.64,34.16 12.64,31.88 12.13,31.37 6.29,31.37 5.4,32.26 J17.1

### Text on the board
tNames: GND | RST | MOSI | MISO | SCK | VCC | DRIVE | AREF | ADC0 | ADC1 | ADC3 | SDA | SCL | GND | RST | SCK | MISO | SDA | SCL | 3V3 | MOSI | VCC | DO NOT / INSTALL | VCC | VCC | GND | DTR | ADC7 | ADC6 | GND | RX_RF | AIN1 | AIN0 | T1 | XCK | +12V | +12V | INT1 | INT0 | TXD | RXD | AUDIO | GND | RXD | TXD
bNames: GND | GND | RST | MOSI | MISO | SCK | VCC | DRIVE | AREF | ADC0 | ADC1 | ADC3 | SDA | SCL | GND | SDA | SCL | 3V3 | RX_RF | XB | XA | CLK1 | CLK0 | K1FM | CLK2 | ADC1 | VCC | ADC0 | AUDIO | Replacement for the / DL2MAN uSDX Main Board / v2.4 - REV C | DRIVE | ADC7 | ADC6 | GND | RX_RF | AIN1 | AIN0 | T1 | XCK | +12V | +12V | INT1 | INT0 | TXD | RXD | AUDIO | GND